# EAGLE design expansion (EAGLE 8.6.0)
CNAME: Fri3d Camp Badge; CREVISION: 2.0; DESIGNER: Christophe VG
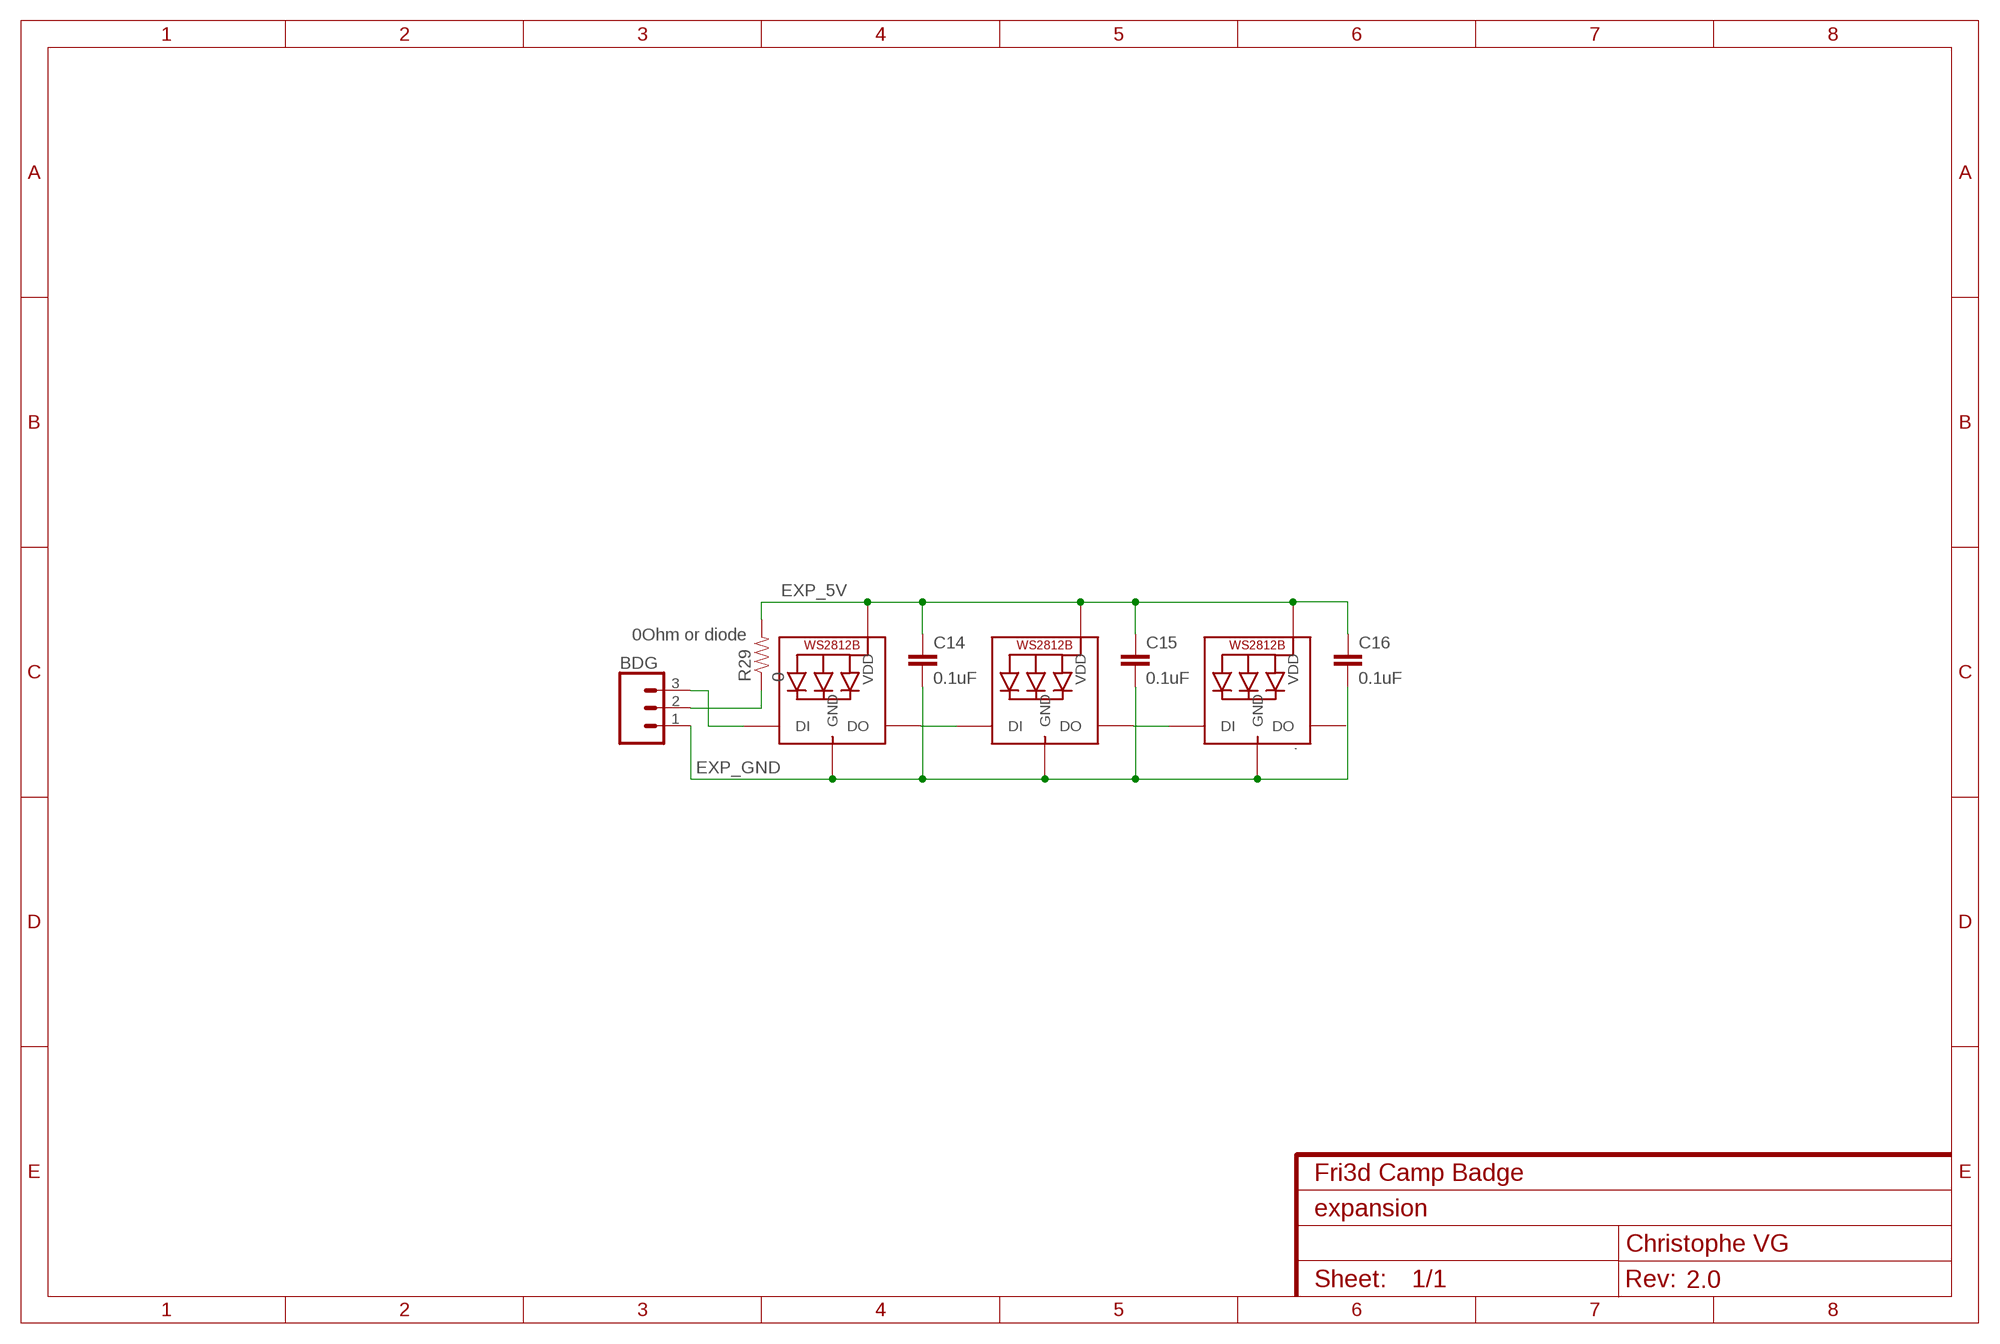
[diagram p0: schematic, sheet 1]

## Parts
BDG  CONN_03  [1X03]
C14  0.1uF  CAP0805  [0805]
C15  0.1uF  CAP0805  [0805]
C16  0.1uF  CAP0805  [0805]
R29  0  RESISTOR0805-RES  [0805]
WS1  WS2812B5050  [WS2812B]
WS2  WS2812B5050  [WS2812B]
WS3  WS2812B5050  [WS2812B]

## Nets
EXP_5V: C14.1 C15.1 C16.1 R29.2 WS1.1-VDD(VDD) WS2.1-VDD(VDD) WS3.1-VDD(VDD)
EXP_GND: BDG.1 C14.2 C15.2 C16.2 WS1.3-GND(GND) WS2.3-GND(GND) WS3.3-GND(GND)
N$16: BDG.2 R29.1
N$17: WS1.2-DOUT(DO) WS2.4-DIN(DI)
N$60: WS2.2-DOUT(DO) WS3.4-DIN(DI)
N$61: BDG.3 WS1.4-DIN(DI)
Unconnected: WS3.2-DOUT(DO)

## Notes on the sheet
- 0Ohm or diode

## Library data of the parts
BDG = SparkFun-Connectors:CONN_03: Multi connection point. Often used as Generic Header-pin footprint for 0.1 inch spaced/style header connections On any of the 0.1 inch spaced packages, you can populate with these: Break Away Headers - Straight <https://www.sparkfun.com/products/116> (PRT-00116) Break Away Male Headers - Right Angle <https://www.sparkfun.com/products/553> (PRT-00553) Female Headers <https://www.sparkfun.com/products/115> (PRT-00115) Break Away Headers - Machine Pin <https://www.sparkfun.com/products/117> (PRT-00117) Break Away Female Headers - Swiss Machine Pin <https://www.sparkfun.com/products/743> (PRT-00743) Stackable Header - 3 Pin (Female, 0.1") <https://www.sparkfun.com/products/13875> (PRT-13875) For SCREWTERMINALS and SPRING TERMINALS visit here: Screw Terimnals on SparkFun.com <https://www.sparkfun.com/search/results?term=Screw+Terminals> (5mm/3.5mm/2.54mm spacing) This device is also useful as a general connection point to wire up your design to another part of your project. Our various solder wires solder well into these plated through hole pads. Hook-Up Wire - Assortment (Stranded, 22 AWG) <https://www.sparkfun.com/products/11375> (PRT-11375) Hook-Up Wire - Assortment (Solid Core, 22 AWG) <https://www.sparkfun.com/products/11367> (PRT-11367) View the entire wire category on our website here <https://www.sparkfun.com/categories/141> Special notes: Molex polarized connector foot print use with SKU : PRT-08232 with associated crimp pins and housings.
C14-C16 = passive:CAP: Capacitor Standard 0603 ceramic capacitor, and 0.1" leaded capacitor.
R29 = passive:RESISTOR: Resistor Basic schematic elements and footprints for 0603, 1206, and PTH resistors.
WS1-WS3 = adafruit:WS2812B

## Board
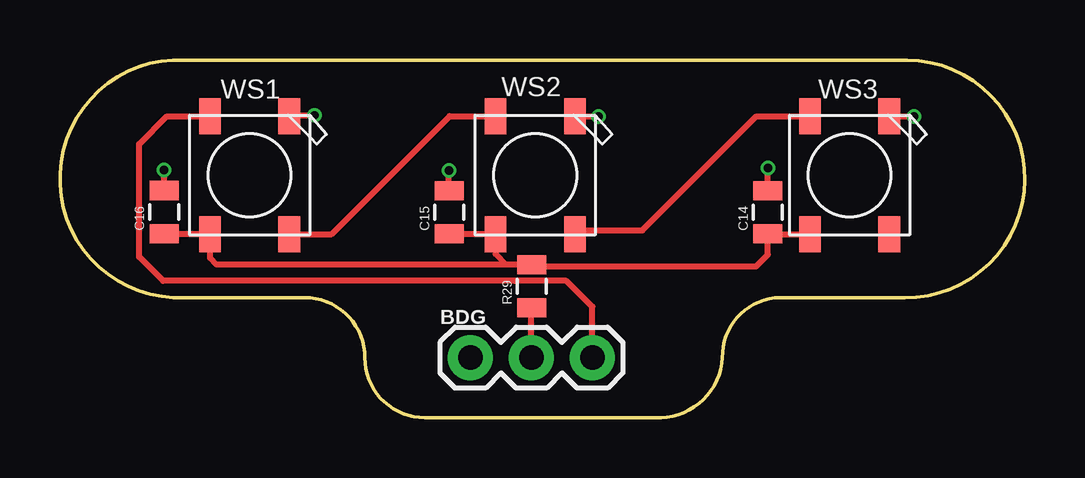
[diagram p1: board, top side]
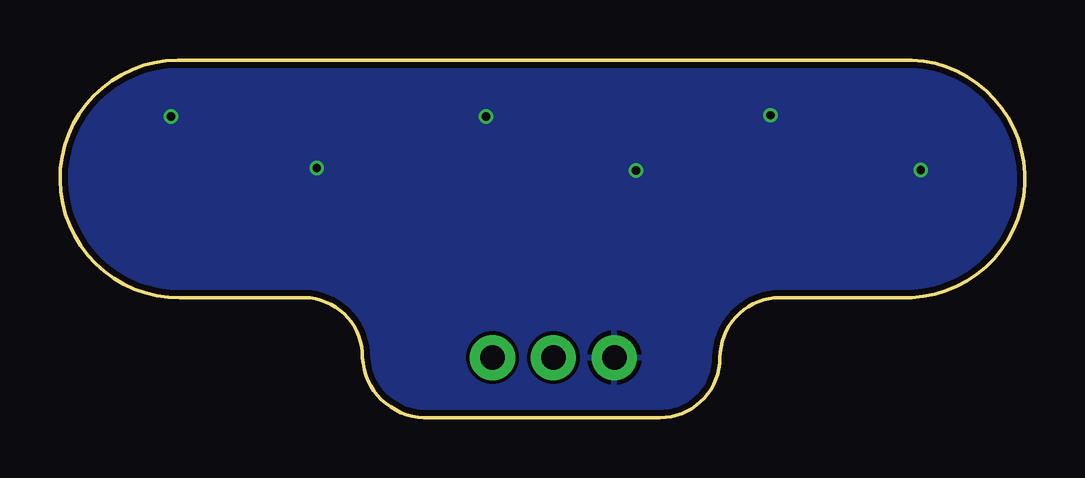
[diagram p2: board, bottom side, seen from below]

Size 40.2 x 14.9 mm. Coordinates in mm from the lower left corner, seen from the top.
Outline: 5.2,5 10.2,5 arc-90 12.7,2.5 arc90 15.2,0 24.8,0 arc90 27.6,2.5 arc-90 30,5 35.2,5 arc180 35.3,14.9 4.7,14.9 arc180 5.2,5
Copper layers (1*16): Top 0.018mm / dielectric 1.55mm / Bottom 0.018mm
Design rules "eC_2Layer_PClass6_BaseCopperO18_eCDefault": minimum track width 0.15mm, minimum drill 0.35mm, track to track 0.15mm, track to pad 0.15mm, pad to pad 0.15mm, via to via 0.15mm, smd to smd 0mil, copper to edge 0.25mm, drill to drill 0.35mm, minimum pad ring 0.175mm, minimum via ring 0.125mm, stop-mask expansion 0mil, vias tented up to drill 0.45mm, thermal gap 0.2mm

### Footprints (pad centres in the part's own frame; a part is rotated, then mirrored left to right if it is on the bottom)
1X03 = drill 1.016 pad 1.88: 1 0,0; 2 2.54,0; 3 5.08,0
0805 = smd 0.8 x 1.2: 1 -0.9,0; 2 0.9,0
WS2812B = smd 1.5 x 0.9: 1-VDD 2.45,-1.65; 2-DOUT 2.45,1.65; 3-GND -2.45,1.65; 4-DIN -2.45,-1.65

### Placement (x,y rotation side)
BDG  17.1,2.5 0 top
C14  29.5,8.56 90 top
C15  16.22,8.56 90 top
C16  4.34,8.56 90 top
R29  19.66,5.48 90 top
WS1  7.9,10.1 270 top
WS2  19.8,10.1 270 top
WS3  32.9,10.1 270 top

### Tracks (layer width: path | path; a pad name or v marks a point on that pad's centre or on a via)
EXP_5V
  Top 0.152: WS1.1-VDD
  Top 0.254: C15.1 WS2.1-VDD 18.15,6.83 18.6,6.38 | 18.6,6.38 R29.2 19.74,6.3 29,6.3 29.5,6.8 29.5,6.81 C14.1 WS3.1-VDD | 18.6,6.38 6.52,6.38 6.25,6.65 WS1.1-VDD | C16.1 WS1.1-VDD
EXP_GND  (via drill 0.35)
  Top 0.254: C16.2 v4.34,10.32 | WS1.3-GND 9.6,12.6 v10.6,12.6 | C15.2 16.2,9.48 v16.2,10.3 | WS2.3-GND 22.44,12.55 v22.45,12.54 | C14.2 v29.5,10.4 | WS3.3-GND v35.57,12.55 v35.58,12.54
  pour Bottom: -0.8,15.4 -0.8,5.2 11.9,4.8 13.9,0.1 25.9,0.1 29.5,5 40.9,5.1 40.9,15.8
N$16
  Top 0.254: BDG.2 19.64,4.56 R29.1
N$17
  Top 0.254: WS1.2-DOUT 11.32,7.65 16.24,12.57 18.14,12.57 WS2.4-DIN
N$60
  Top 0.254: WS2.2-DOUT 21.6,7.8 24.27,7.8 29.02,12.55 WS3.4-DIN
N$61
  Top 0.254: BDG.3 22.18,4.62 21.1,5.7 18.95,5.7 18.94,5.7 4.3,5.7 3.3,6.7 3.3,11.4 4.45,12.55 WS1.4-DIN